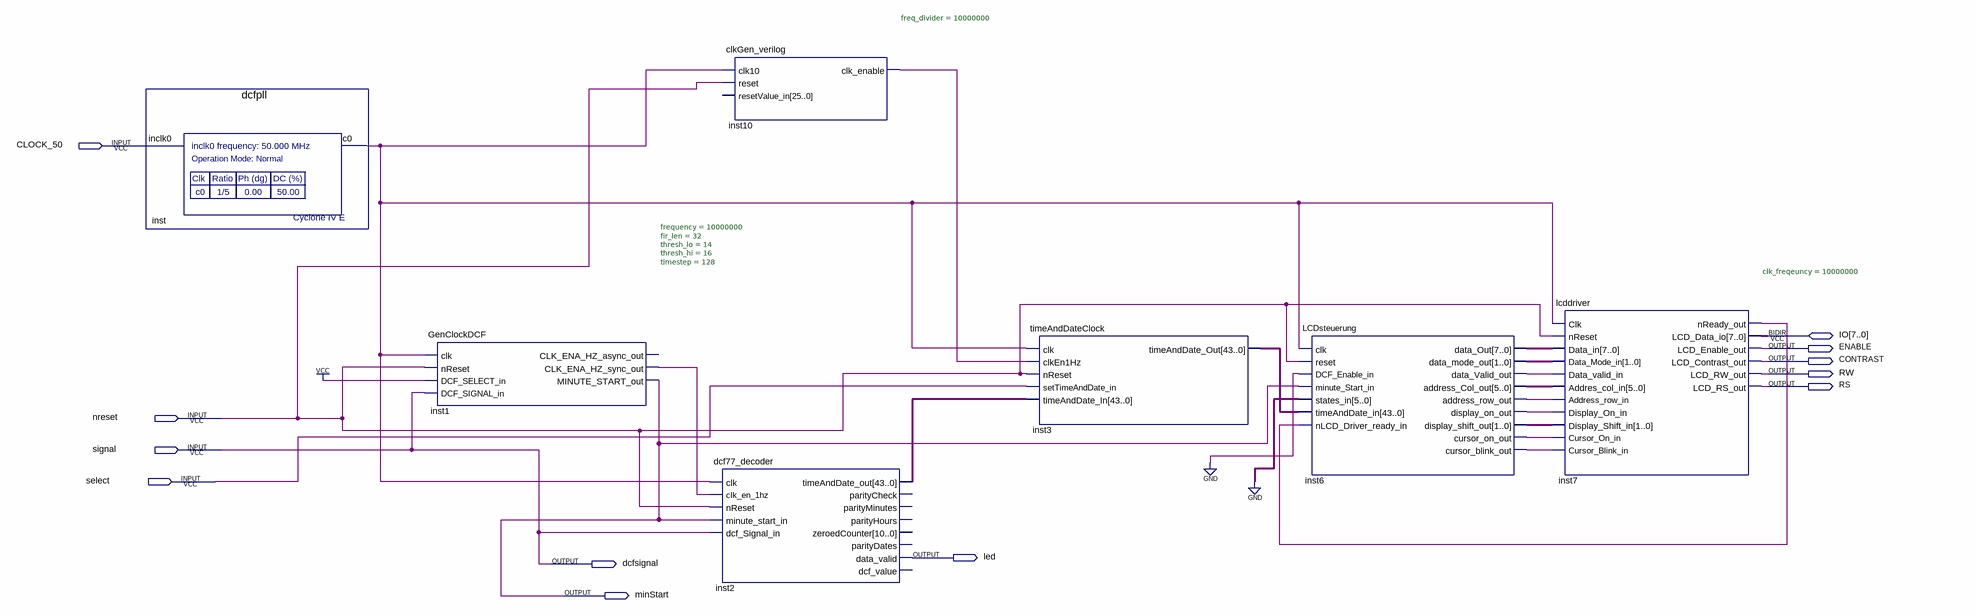
[diagram p0: schematic sheet]
// Quartus schematic dcf77.bdf as structural Verilog: 7 symbols, 12 pins
module dcf77 (
  input  CLOCK_50,
  input  nreset,
  input  signal,
  input  select,
  inout  [7:0] IO,
  output ENABLE,
  output CONTRAST,
  output RW,
  output RS,
  output led,
  output dcfsignal,
  output minStart
);

  wire inst1_clk_ena_hz_sync_out, inst6_address_row_out, inst6_cursor_blink_out, inst6_cursor_on_out,
       inst6_data_valid_out, inst6_display_on_out, inst7_nready_out, inst10_clk_enable, inst_c0;
  wire [1:0] inst6_data_mode_out, inst6_display_shift_out;
  wire [5:0] inst6_address_col_out;
  wire [7:0] inst6_data_out;
  wire [43:0] inst2_timeanddate_out, inst3_timeanddate_out;

  dcfpll inst (.inclk0(CLOCK_50), .c0(inst_c0));
  GenClockDCF #(.frequency(10000000), .fir_len(32), .thresh_lo(14), .thresh_hi(16), .timestep(128)) inst1 (
    .clk(inst_c0), .nReset(nreset), .DCF_SELECT_in(1'b1), .DCF_SIGNAL_in(signal),
    .CLK_ENA_HZ_sync_out(inst1_clk_ena_hz_sync_out), .MINUTE_START_out(minStart));  // open: CLK_ENA_HZ_async_out
  clkGen_verilog #(.freq_divider(10000000)) inst10 (
    .clk10(inst_c0), .reset(nreset), .clk_enable(inst10_clk_enable));  // open: resetValue_in
  dcf77_decoder inst2 (
    .clk(inst_c0), .clk_en_1hz(inst1_clk_ena_hz_sync_out), .nReset(nreset), .minute_start_in(minStart),
    .dcf_Signal_in(signal), .timeAndDate_out(inst2_timeanddate_out), .data_valid(led));  // open: parityCheck, parityMinutes, parityHours, zeroedCounter, parityDates, dcf_value
  timeAndDateClock inst3 (
    .clk(inst_c0), .clkEn1Hz(inst10_clk_enable), .nReset(nreset), .setTimeAndDate_in(select),
    .timeAndDate_In(inst2_timeanddate_out), .timeAndDate_Out(inst3_timeanddate_out));
  LCDsteuerung inst6 (
    .clk(inst_c0), .reset(nreset), .DCF_Enable_in(1'b0), .minute_Start_in(minStart), .states_in({6{1'b0}}),
    .timeAndDate_in(inst3_timeanddate_out), .nLCD_Driver_ready_in(inst7_nready_out),
    .data_Out(inst6_data_out), .data_mode_out(inst6_data_mode_out), .data_Valid_out(inst6_data_valid_out),
    .address_Col_out(inst6_address_col_out), .address_row_out(inst6_address_row_out),
    .display_on_out(inst6_display_on_out), .display_shift_out(inst6_display_shift_out),
    .cursor_on_out(inst6_cursor_on_out), .cursor_blink_out(inst6_cursor_blink_out));
  lcddriver #(.clk_freqeuncy(10000000)) inst7 (
    .Clk(inst_c0), .nReset(nreset), .Data_in(inst6_data_out), .Data_Mode_in(inst6_data_mode_out),
    .Data_valid_in(inst6_data_valid_out), .Addres_col_in(inst6_address_col_out),
    .Address_row_in(inst6_address_row_out), .Display_On_in(inst6_display_on_out),
    .Display_Shift_in(inst6_display_shift_out), .Cursor_On_in(inst6_cursor_on_out),
    .Cursor_Blink_in(inst6_cursor_blink_out), .nReady_out(inst7_nready_out), .LCD_Enable_out(ENABLE),
    .LCD_Contrast_out(CONTRAST), .LCD_RW_out(RW), .LCD_RS_out(RS), .LCD_Data_io(IO));

  assign dcfsignal = signal;
endmodule
